# EAGLE design CS_COMM (EAGLE 9.5.0)
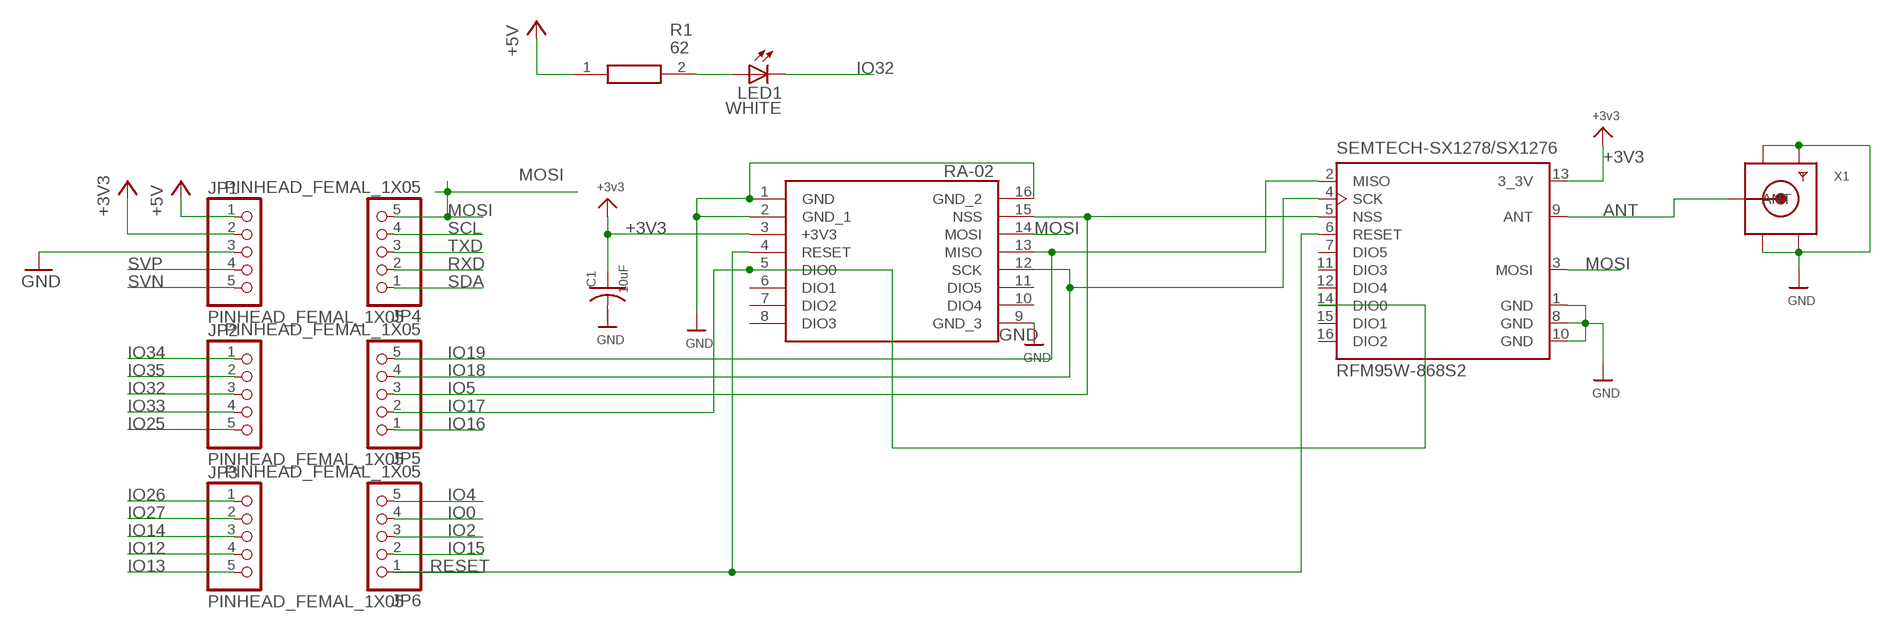
[diagram p0: schematic, sheet 1]

## Parts
AI-THINKER_RA-02  RA-02SMD-16  [SON200P1600X1650X200-16]
C1  10uF  C-USC0805  [C0805]
JP1  PINHEAD_FEMAL_1X05  [1X05F]
JP2  PINHEAD_FEMAL_1X05  [1X05F]
JP3  PINHEAD_FEMAL_1X05  [1X05F]
JP4  PINHEAD_FEMAL_1X05  [1X05F]
JP5  PINHEAD_FEMAL_1X05  [1X05F]
JP6  PINHEAD_FEMAL_1X05  [1X05F]
LED1  WHITE  LEDCHIPLED_1206  [CHIPLED_1206]
R1  62  ERA-6AED684V  [RESC2012X60N]
SEMTECH-SX1278/SX1276  RFM95W-868S2  [XCVR_RFM95W-868S2]
X1  SMACONNECTOR  [SMA90_DIP]

## Nets
+3V3: AI-THINKER_RA-02.3(+3V3) C1.1 JP1.2 SEMTECH-SX1278/SX1276.13(3_3V) ; supply symbol labelled +3v3
+5V: JP1.1 R1.1
ANT: SEMTECH-SX1278/SX1276.9(ANT) X1.ANTENNA(ANT)
GND: AI-THINKER_RA-02.1(GND) AI-THINKER_RA-02.2(GND_1) AI-THINKER_RA-02.9(GND_3) AI-THINKER_RA-02.16(GND_2) C1.2 JP1.3 SEMTECH-SX1278/SX1276.1(GND) SEMTECH-SX1278/SX1276.8(GND) SEMTECH-SX1278/SX1276.10(GND) X1.GND1 X1.GND2 X1.GND3 X1.GND4
IO0: JP6.4
IO2: JP6.3
IO4: JP6.5
IO5: AI-THINKER_RA-02.15(NSS) JP5.3 SEMTECH-SX1278/SX1276.5(NSS)
IO12: JP3.4
IO13: JP3.5
IO14: JP3.3
IO15: JP6.2
IO16: JP5.1
IO17: AI-THINKER_RA-02.5(DIO0) JP5.2 SEMTECH-SX1278/SX1276.14(DIO0)
IO18: AI-THINKER_RA-02.12(SCK) JP5.4 SEMTECH-SX1278/SX1276.4(SCK)
IO19: AI-THINKER_RA-02.13(MISO) JP5.5 SEMTECH-SX1278/SX1276.2(MISO)
IO25: JP2.5
IO26: JP3.1
IO27: JP3.2
IO32: JP2.3 LED1.C
IO33: JP2.4
IO34: JP2.1
IO35: JP2.2
MOSI: AI-THINKER_RA-02.14(MOSI) JP4.5 SEMTECH-SX1278/SX1276.3(MOSI)
N$1: LED1.A R1.2
RESET: AI-THINKER_RA-02.4(RESET) JP6.1 SEMTECH-SX1278/SX1276.6(RESET)
RXD: JP4.2
SCL: JP4.4
SDA: JP4.1
SVN: JP1.5
SVP: JP1.4
TXD: JP4.3
Unconnected: AI-THINKER_RA-02.6(DIO1) AI-THINKER_RA-02.7(DIO2) AI-THINKER_RA-02.8(DIO3) AI-THINKER_RA-02.10(DIO4) AI-THINKER_RA-02.11(DIO5) SEMTECH-SX1278/SX1276.7(DIO5) SEMTECH-SX1278/SX1276.11(DIO3) SEMTECH-SX1278/SX1276.12(DIO4) SEMTECH-SX1278/SX1276.15(DIO1) SEMTECH-SX1278/SX1276.16(DIO2)

## Library data of the parts
AI-THINKER_RA-02 = my-lib:RA-02
C1 = rcl:C-US: CAPACITOR, American symbol; SPICEPREFIX: C
JP1-JP6 = SamacSys_3D:PINHEAD_FEMAL_1X05
LED1 = adafruit:LED: LED OSRAM: - CHIPLED LG R971, LG N971, LY N971, LG Q971, LY Q971, LO R971, LY R971 LH N974, LH R974 LS Q976, LO Q976, LY Q976 LO Q996 - Hyper CHIPLED LW Q18S LB Q993, LB Q99A, LB R99A - SideLED LS A670, LO A670, LY A670, LG A670, LP A670 LB A673, LV A673, LT A673, LW A673 LH A674 LY A675 LS A676, LA A676, LO A676, LY A676, LW A676 LS A679, LY A679, LG A679 - Hyper Micro SIDELED® LS Y876, LA Y876, LO Y876, LY Y876 LT Y87S - SmartLED LW L88C, LW L88S LB L89C, LB L89S, LG L890 LS L89K, LO L89K, LY L89K LS L896, LA L896, LO L896, LY L896 - TOPLED LS T670, LO T670, LY T670, LG T670, LP T670 LSG T670, LSP T670, LSY T670, LOP T670, LYG T670 LG T671, LOG T671, LSG T671 LB T673, LV T673, LT T673, LW T673 LH T674 LS T676, LA T676, LO T676, LY T676, LB T676, LH T676, LSB T676, LW T676 LB T67C, LV T67C, LT T67C, LS T67K, LO T67K, LY T67K, LW E67C LS E67B, LA E67B, LO E67B, LY E67B, LB E67C, LV E67C, LT E67C LW T67C LS T679, LY T679, LG T679 LS T770, LO T770, LY T770, LG T770, LP T770 LB T773, LV T773, LT T773, LW T773 LH T774 LS E675, LA E675, LY E675, LS T675 LS T776, LA T776, LO T776, LY T776, LB T776 LHGB T686 LT T68C, LB T68C - Hyper Mini TOPLED® LB M676 - Mini TOPLED Santana® LG M470 LS M47K, LO M47K, LY M47K Source: http://www.osram.convergy.de/
R1 = SamacSys_3D:ERA-6AED684V: Thin Film Resistors - SMD 0805 680Kohms 25ppm 0.5% AEC-Q200 Source: Datasheet <https://industrial.panasonic.com/cdbs/www-data/pdf/RDA0000/AOA0000C237.pdf>; DESCRIPTION: Thin Film Resistors - SMD 0805 680Kohms 25ppm 0.5% AEC-Q200; HEIGHT: 0.6mm; MANUFACTURER_NAME: Panasonic; MANUFACTURER_PART_NUMBER: ERA-6AED684V; MOUSER_PART_NUMBER: 667-ERA-6AED684V; MOUSER_PRICE-STOCK: https://www.mouser.com/Search/Refine.aspx?Keyword=667-ERA-6AED684V
SEMTECH-SX1278/SX1276 = SamacSys_3D:RFM95W-868S2: Mod Txrx Lora +20dbm 868mhz Smd; DIGI-KEY_PART_NUMBER: RFM95W-868S2-ND; DIGI-KEY_PURCHASE_URL: https://www.digikey.in/product-detail/en/rf-solutions/RFM95W-868S2/RFM95W-868S2-ND/5051755?utm_source=snapeda&utm_medium=aggregator&utm_campaign=symbol; MF: RF; MP: RFM95W-868S2; PACKAGE: SMD-16 Hope Microelectronics
X1 = adafruit:SMACONNECTOR: SMA Connector 90° DIP SMA Connector, 50 Ohm (4UConnector: 07259)

## Board
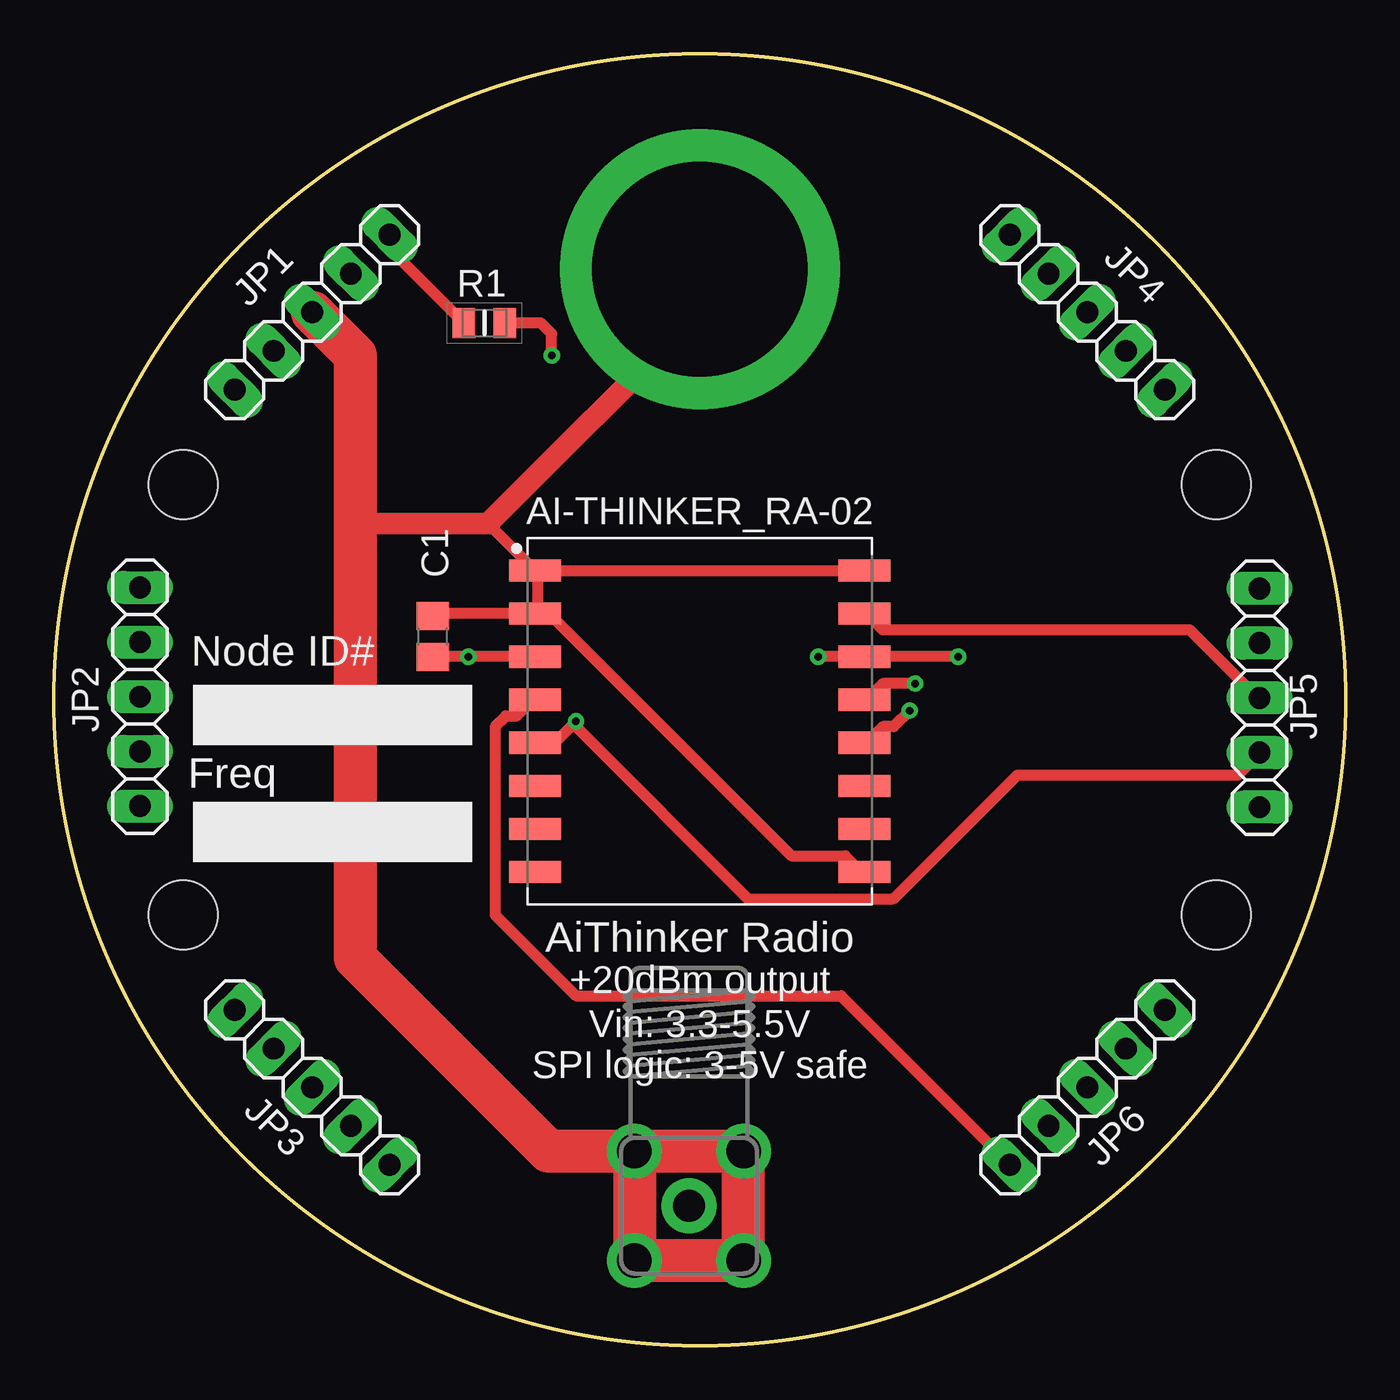
[diagram p1: board, top side]
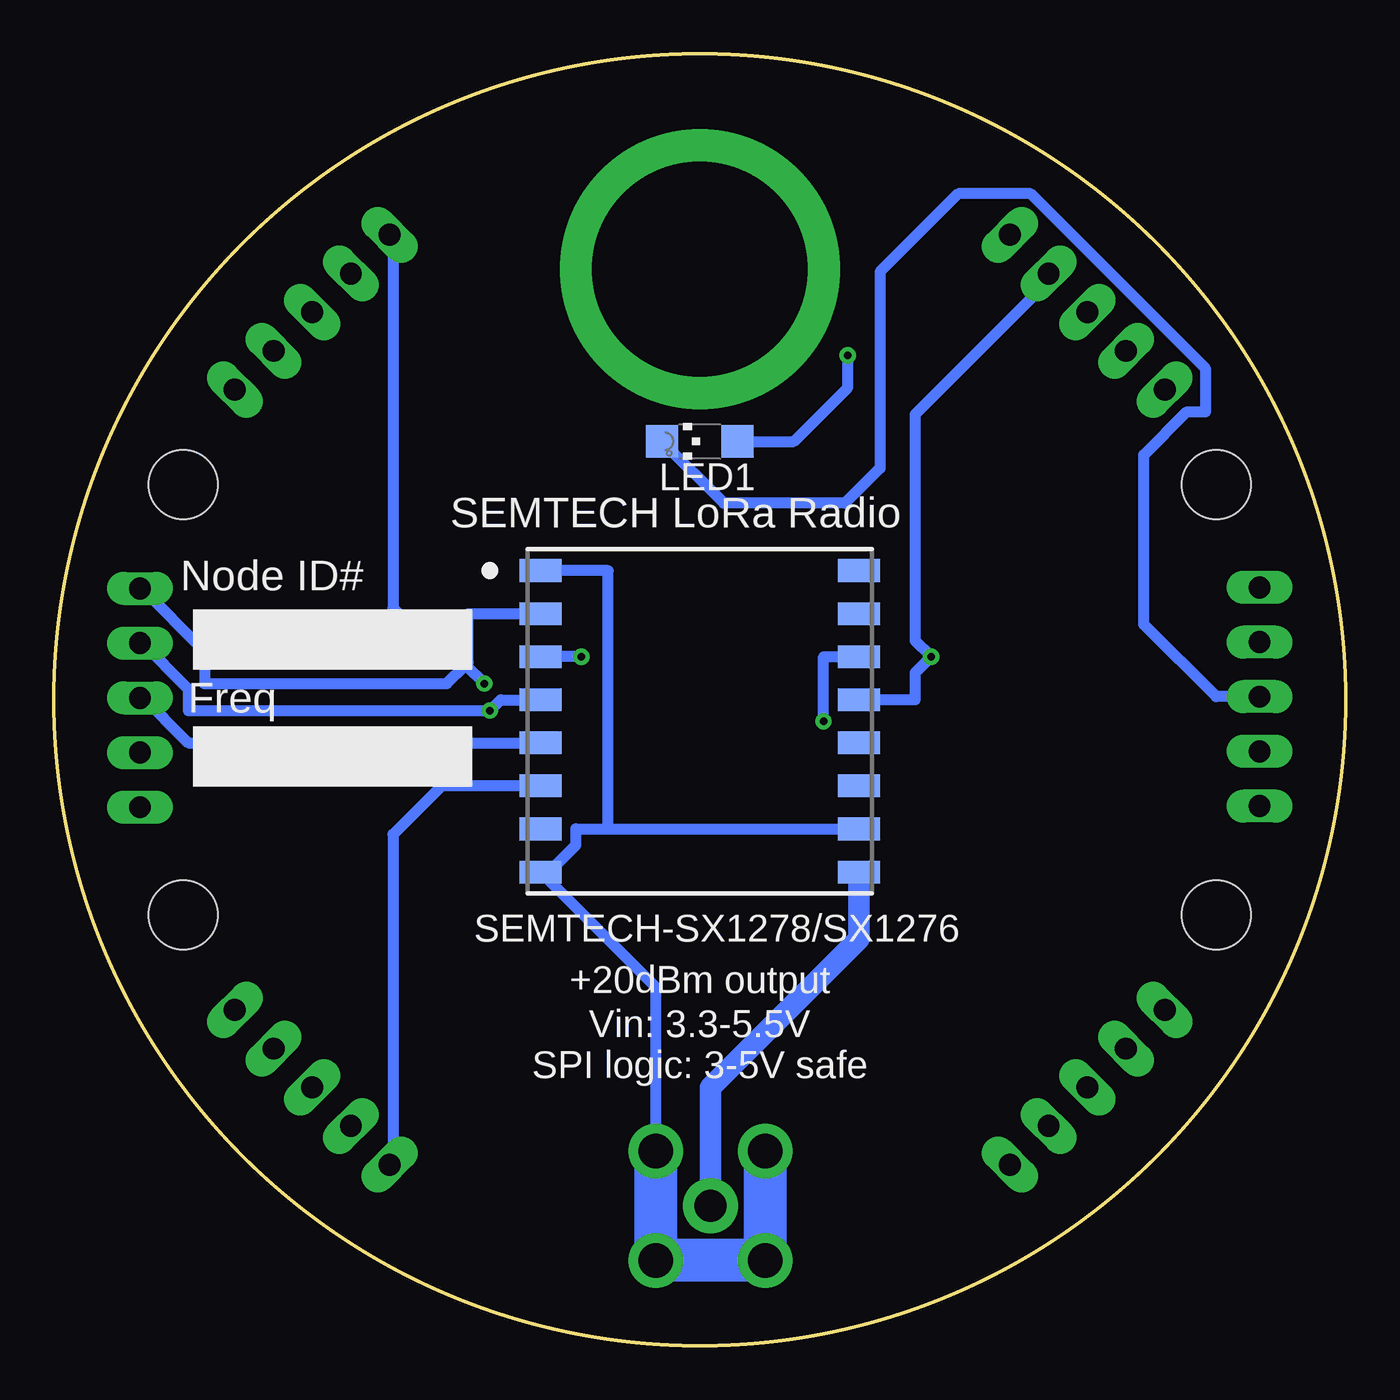
[diagram p2: board, bottom side, seen from below]

Size 60 x 60 mm. Coordinates in mm from the lower left corner, seen from the top.
Outline: circle at 30,30 radius 30
Copper layers (1*16): Top 0.035mm / dielectric 1.5mm / Bottom 0.035mm
Design rules "CanSat": minimum track width 0.4mm, minimum drill 0.35mm, track to track 8mil, track to pad 10mil, pad to pad 8mil, via to via 15mil, smd to smd 6mil, copper to edge 1.5mm, drill to drill 10mil, minimum pad ring 10mil, minimum via ring 8mil, stop-mask expansion 6mil, vias tented up to drill 0mil, thermal gap 8mil
Holes 3.2 mm at 6,40 54,40 54,20 6,20

### Footprints (pad centres in the part's own frame; a part is rotated, then mirrored left to right if it is on the bottom)
SON200P1600X1650X200-16 = smd 2.412 x 1.032: 1 -7.65,6; 2 -7.65,4; 3 -7.65,2; 4 -7.65,0; 5 -7.65,-2; 6 -7.65,-4; 7 -7.65,-6; 8 -7.65,-8; 9 7.65,-8; 10 7.65,-6; 11 7.65,-4; 12 7.65,-2; 13 7.65,0; 14 7.65,2; 15 7.65,4; 16 7.65,6
C0805 = smd 1.3 x 1.5: 1 -0.95,0; 2 0.95,0
1X05F = drill 1.016 long: 1 -5.08,0; 2 -2.54,0; 3 0,0; 4 2.54,0; 5 5.08,0
CHIPLED_1206 = smd 1.5 x 1.5: A 0,-1.75; C 0,1.75
RESC2012X60N = smd 1.05 x 1.4: 1 -0.95,0; 2 0.95,0
XCVR_RFM95W-868S2 = smd 1.95 x 1.05: 1 -7.4,7; 2 -7.4,5; 3 -7.4,3; 4 -7.4,1; 5 -7.4,-1; 6 -7.4,-3; 7 -7.4,-5; 8 -7.4,-7; 9 7.4,-7; 10 7.4,-5; 11 7.4,-3; 12 7.4,-1; 13 7.4,1; 14 7.4,3; 15 7.4,5; 16 7.4,7
SMA90_DIP = drill 1.5 pad 2.54: ANTENNA 0,0 | drill 1.6 pad 2.54: GND1 -2.54,2.54; GND2 2.54,2.54; GND3 -2.54,-2.54; GND4 2.54,-2.54

### Placement (x,y rotation side)
AI-THINKER_RA-02  30,30 0 top
C1  17.6,32.94 90 top
JP1  12,48 225 top
JP2  4,30.14 270 top
JP3  12,12 315 top
JP4  48,48 135 top
JP5  56,30.09 90 top
JP6  48,12 45 top
LED1  30,42 90 bottom
R1  20,47.5 0 top
SEMTECH-SX1278/SX1276  30,29 0 bottom
X1  29.5,6.5 0 top

### Tracks (layer width: path | path; a pad name or v marks a point on that pad's centre or on a via)
+3V3  (via drill 0.35)
  Top 0.5: AI-THINKER_RA-02.3 v19.25,32 17.75,32 C1.1
  Bottom 0.5: SEMTECH-SX1278/SX1276.13 20,30 20,31.25 v19.25,32 20,32.75 20,43.25 14,49.25 14,49.75 JP1.2
+5V
  Top 0.5: R1.1 15.59,50.96 JP1.1
ANT
  Bottom 1: SEMTECH-SX1278/SX1276.9 22.6,18.9 29.5,12 X1.ANTENNA
GND  (via drill 10 pad 13)
  Top 0.5: 22.5,34 23,34 34.25,22.75 36.75,22.75 37.5,22 AI-THINKER_RA-02.9 | 22.5,34 22.5,36 | 22.5,34 AI-THINKER_RA-02.2 17.75,34 C1.2 | 22.5,36 AI-THINKER_RA-02.16 | 22.5,36 AI-THINKER_RA-02.1 20.18,38.17
  Top 1: v30,50 30,48 20.18,38.17 14.18,38.17 14,38
  Top 2: JP1.3 14,46 14,38 14,18 22.96,9.04 X1.GND1 | X1.GND1 X1.GND3 X1.GND4 X1.GND2 X1.GND1
  Bottom 0.5: 34.25,24 35.75,24 35.75,23.25 37,22 SEMTECH-SX1278/SX1276.8 32.04,16.64 X1.GND2 | 34.25,24 SEMTECH-SX1278/SX1276.10 | SEMTECH-SX1278/SX1276.1 34.25,36 34.25,24
  Bottom 2: X1.GND1 X1.GND3 X1.GND4 X1.GND2
IO5
  Top 0.5: AI-THINKER_RA-02.15 37.75,34 38.5,33.25 52.75,33.25 55.75,30.25 56,30.25 JP5.3
  Bottom 0.5: SEMTECH-SX1278/SX1276.5 53.75,28 56,30.25 JP5.3
IO17  (via drill 0.35)
  Top 0.5: AI-THINKER_RA-02.5 23.25,28 v24.25,29 24.25,28.75 32.25,20.75 39,20.75 44.75,26.5 55,26.5 56,27.5 JP5.2
  Bottom 0.5: SEMTECH-SX1278/SX1276.14 24.25,32 v24.25,29
IO18  (via drill 0.35)
  Top 0.5: v39.75,29.5 39,28.75 38.5,28.75 37.75,28 AI-THINKER_RA-02.12
  Bottom 0.5: SEMTECH-SX1278/SX1276.4 39.25,30 v39.75,29.5 53.75,29.5 53.75,30.5 56,32.75 JP5.4
IO19  (via drill 0.35)
  Top 0.5: v40,30.75 38.5,30.75 37.75,30 AI-THINKER_RA-02.13
  Bottom 0.5: SEMTECH-SX1278/SX1276.2 40.75,34 40.75,31.75 40.88,31.62 | 40.88,31.62 41.75,30.75 53,30.75 53,32.25 56,35.25 JP5.5 | 40.88,31.62 v40,30.75
IO32
  Bottom 0.5: LED1.C 28.88,39.12 23.25,39.12 21.62,40.75 21.62,49.88 18,53.5 14.62,53.5 6.5,45.38 6.5,43.38 7.38,43.38 9.38,41.38 9.38,33.5 6.02,30.14 JP2.3
MOSI  (via drill 0.35)
  Top 0.5: v35.5,32 AI-THINKER_RA-02.14 v42,32
  Bottom 0.5: v35.5,32 SEMTECH-SX1278/SX1276.3 | v42,32 44.25,34.25 44.25,51.5 JP4.5
N$1  (via drill 0.35)
  Top 0.5: v23.12,46 23.12,47 22.62,47.5 R1.2
  Bottom 0.5: v23.12,46 23.12,44.5 25.62,42 LED1.A
RESET
  Top 0.5: AI-THINKER_RA-02.4 22.25,30 21.5,29.25 21,29.25 20.5,28.75 20.5,20 24.25,16.25 36.57,16.25 JP6.1
  Bottom 0.5: SEMTECH-SX1278/SX1276.6 42,26 44.25,23.75 44.25,8.5 JP6.1

### Text on the board
tPlace: Node ID# | Freq | AiThinker Radio | +20dBm output | Vin: 3.3-5.5V / SPI logic: 3-5V safe
bPlace: SEMTECH LoRa Radio | Node ID# | Freq | +20dBm output | Vin: 3.3-5.5V / SPI logic: 3-5V safe